# Altium schematic sheet p2_half_bridge.SchDoc
size A1; Organization: Protel International P/L; Address1: L3, 12a Rodborough Rd; Address2: Frenchs Forest; Address3: NSW; Address4: Australia 2086
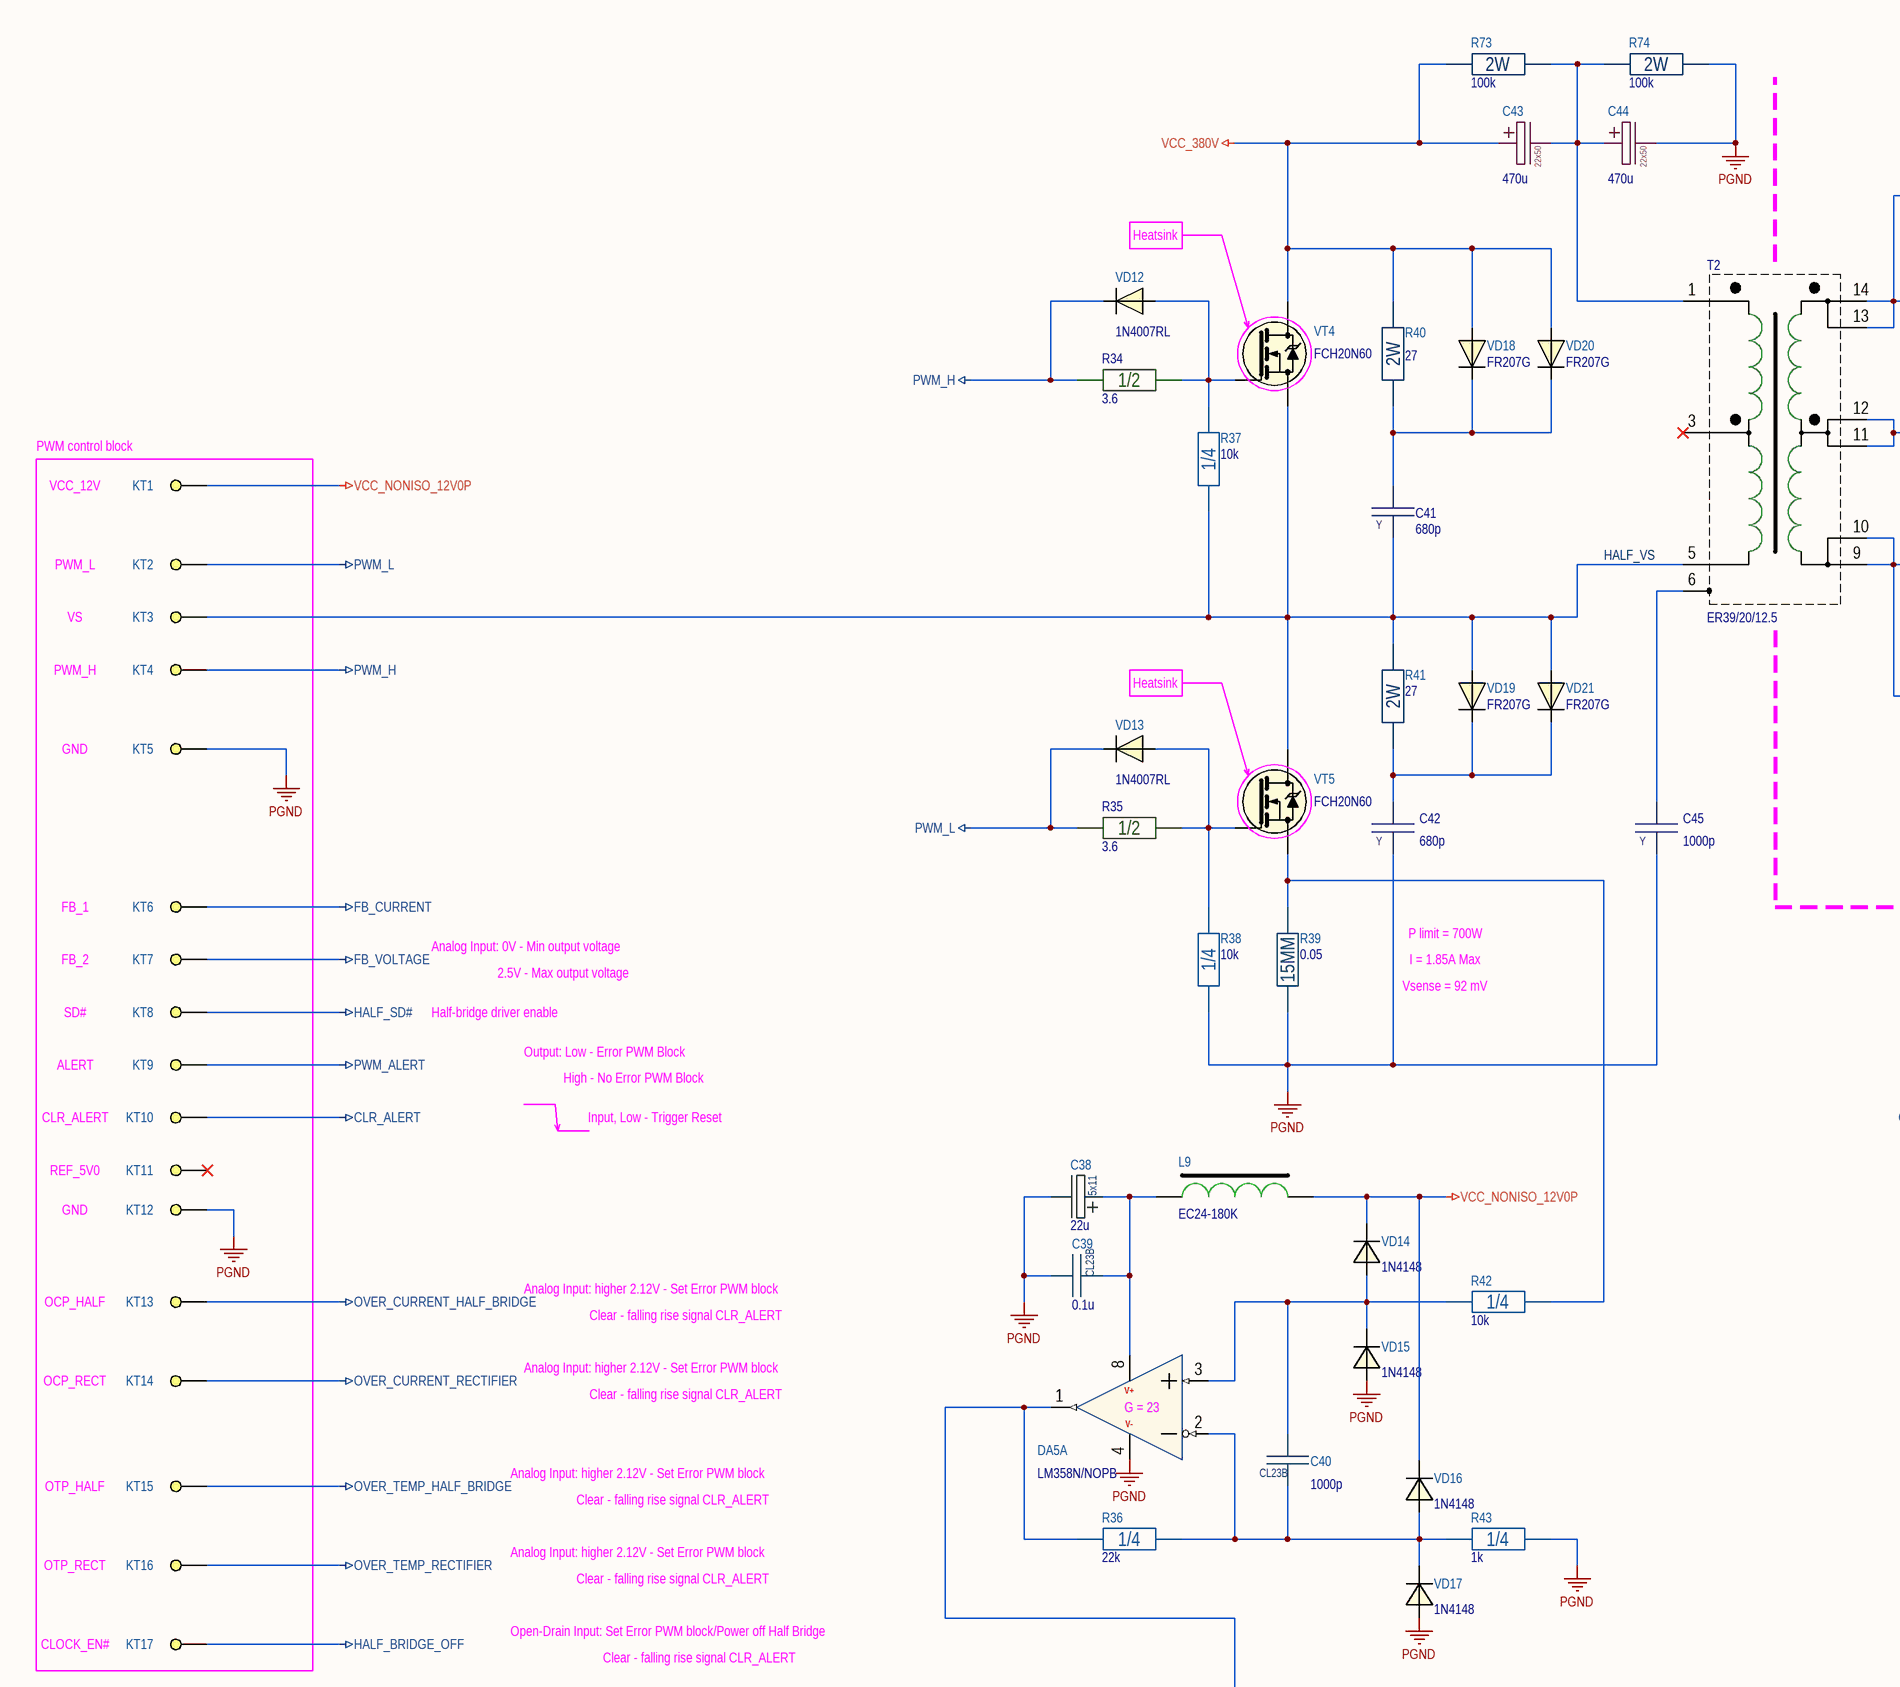
[diagram p0: p2_half_bridge.SchDoc, top left]
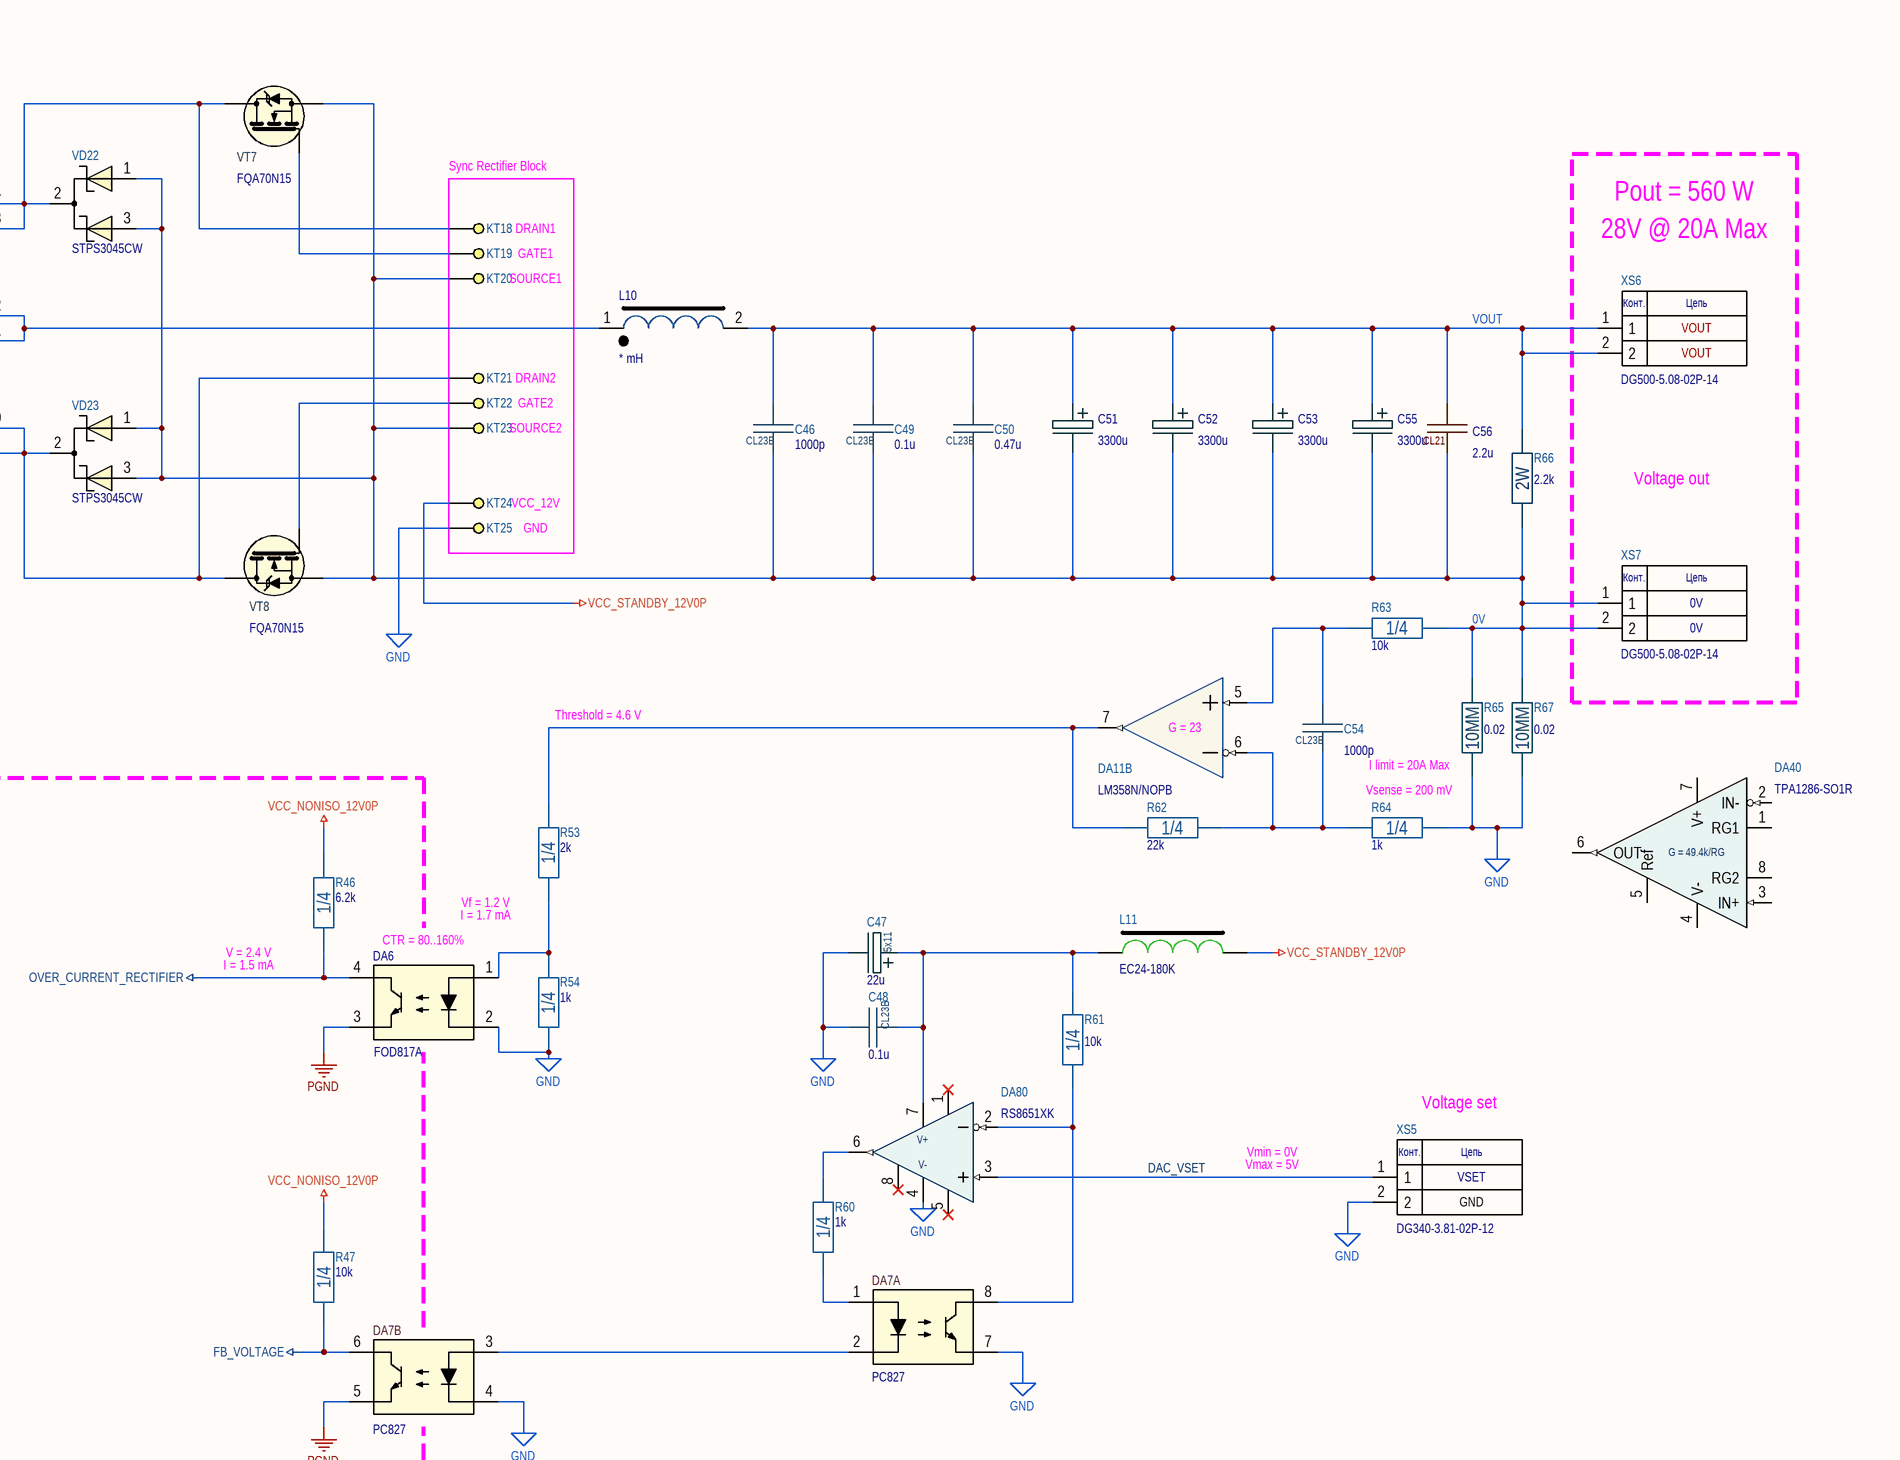
[diagram p1: p2_half_bridge.SchDoc, top right]
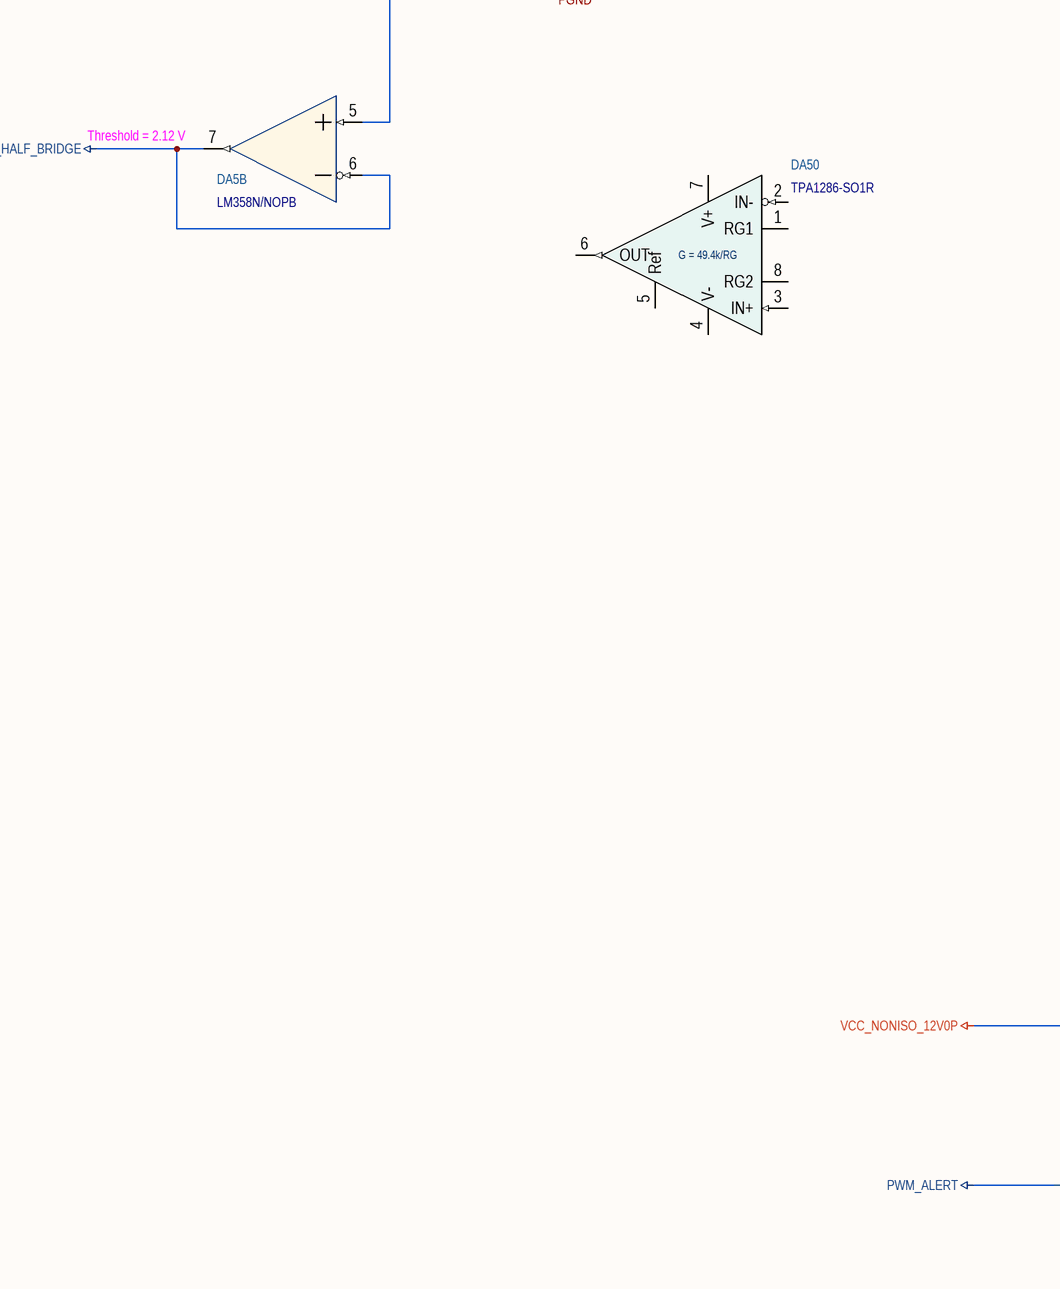
[diagram p2: p2_half_bridge.SchDoc, bottom left]
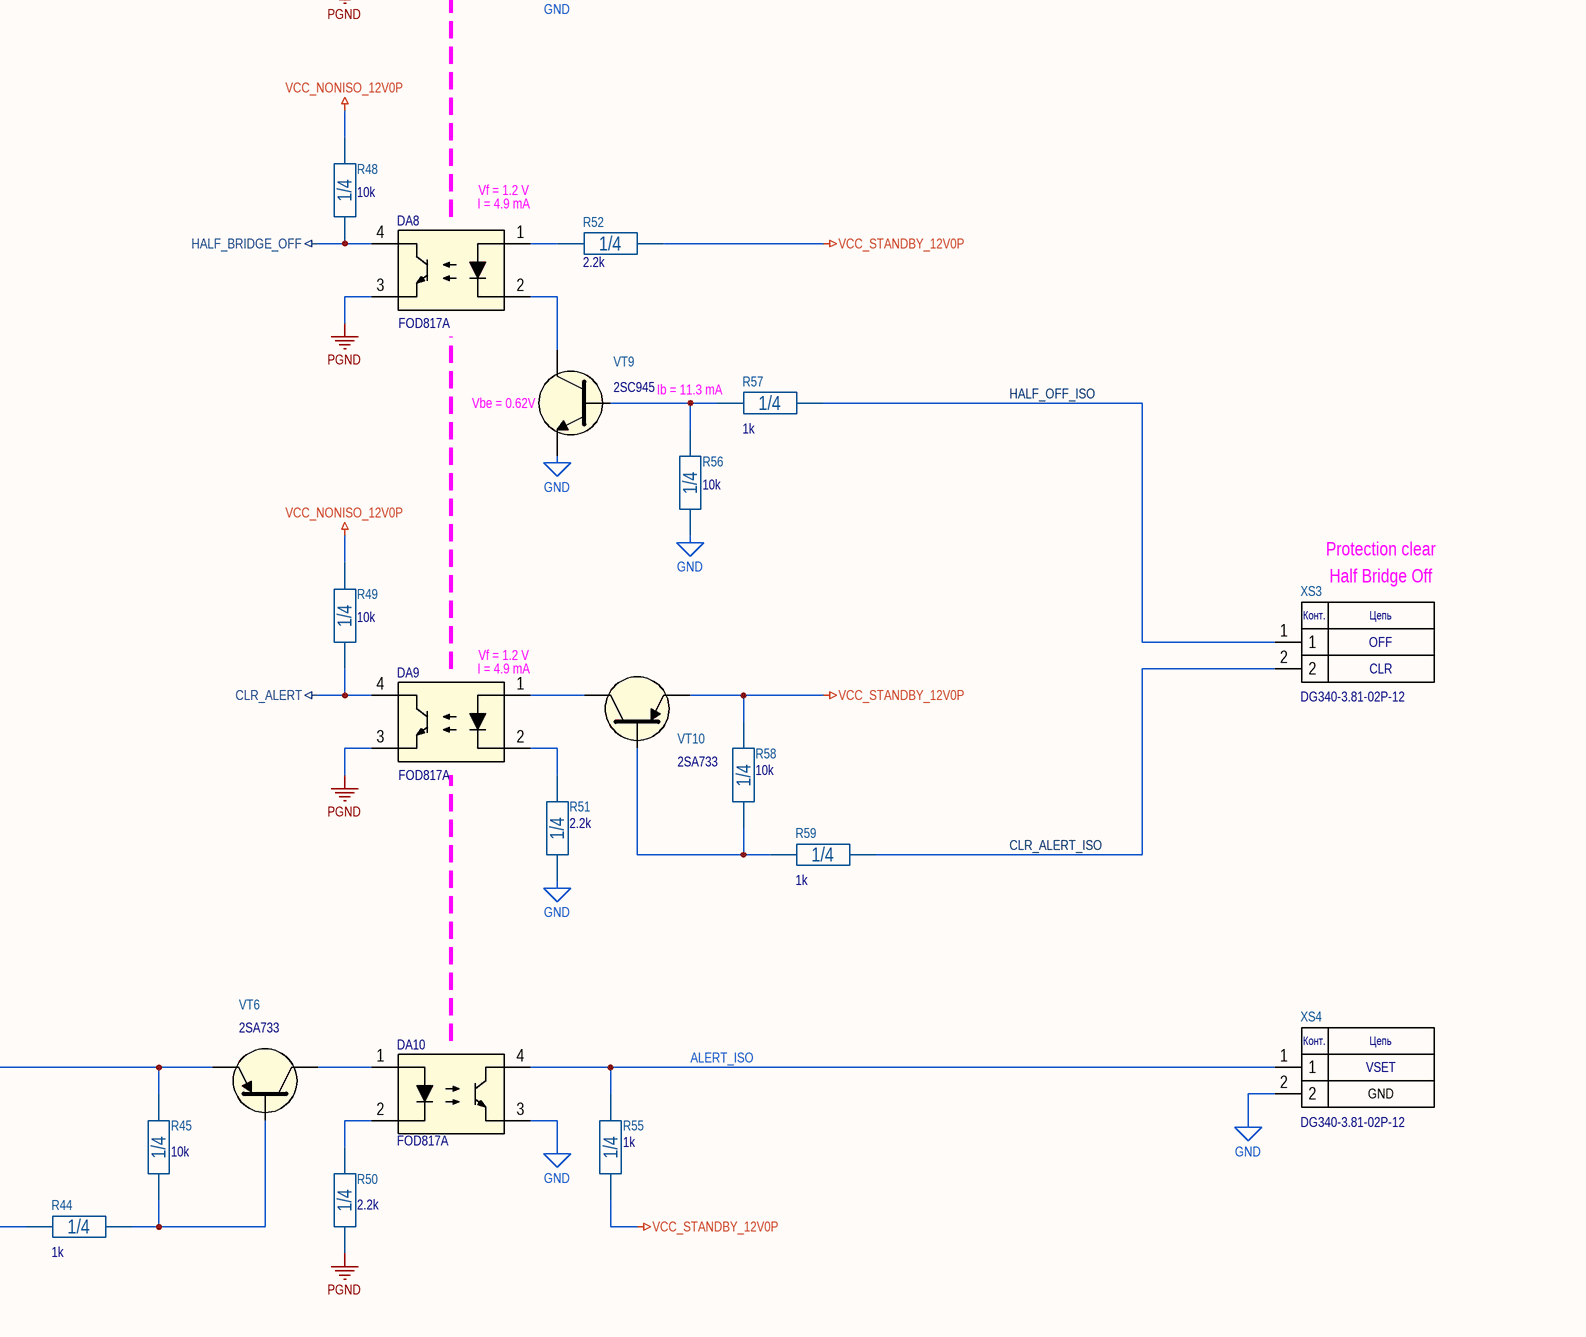
[diagram p3: p2_half_bridge.SchDoc, bottom right]

## Parts
C38  22u  Package: 5x11  [ECAP5X11X2.0_BRW]
C39  0.1u  [CL23B_7.2x2.5]
C40  1000p  [CL23B_7.2x2.5]
C41  680p  Package: Y  [JYC_Y2_CAP_7.5]
C42  680p  Package: Y  [JYC_Y2_CAP_7.5]
C43  470u  Package: 22x50  [ECAP22X50X10]
C44  470u  Package: 22x50  [ECAP22X50X10]
C45  1000p  Package: Y  [JYC_Y2_CAP_7.5]
C46  1000p  [CL23B_7.2x2.5]
C47  22u  Package: 5x11  [ECAP5X11X2.0_BRW]
C48  0.1u  [CL23B_7.2x2.5]
C49  0.1u  [CL23B_7.2x2.5]
C50  0.47u  [CL23B_7.2x3.5]
C51  3300u  [ECAP16X36X75_BLK]
C52  3300u  [ECAP16X36X75_BLK]
C53  3300u  [ECAP16X36X75_BLK]
C54  1000p  [CL23B_7.2x2.5]
C55  3300u  [ECAP16X36X75_BLK]
C56  2.2u  [CL21_29x24.5x14.0_P27.5]
DA5  LM358N/NOPB  [DIP-8P-M01_with_SO8]  (parts A,B of 2)
DA6  FOD817A  [DIP-4P]
DA7  PC827  [DIP-8P-M01]  (parts A,B of 2)
DA8  FOD817A  [DIP-4P]
DA9  FOD817A  [DIP-4P]
DA10  FOD817A  [DIP-4P]
DA11  LM358N/NOPB  [DIP-8P-M01_with_SO8]  (part B of 2)
DA40  TPA1286-SO1R  [SOIC-8]
DA50  TPA1286-SO1R  [SOIC-8]
DA80  RS8651XK  [SOIC-8]
KT1  TEST_PAD  [TEST_PAD_HOLE1.1x1.8SQ]  (value not drawn)  (net tie, no BOM)
KT2  TEST_PAD  [TEST_PAD_HOLE1.1x1.8]  (value not drawn)  (net tie, no BOM)
KT3  TEST_PAD  [TEST_PAD_HOLE1.1x1.8]  (value not drawn)  (net tie, no BOM)
KT4  TEST_PAD  [TEST_PAD_HOLE1.1x1.8]  (value not drawn)  (net tie, no BOM)
KT5  TEST_PAD  [TEST_PAD_HOLE1.1x1.8]  (value not drawn)  (net tie, no BOM)
KT6  TEST_PAD  [TEST_PAD_HOLE1.1x1.8]  (value not drawn)  (net tie, no BOM)
KT7  TEST_PAD  [TEST_PAD_HOLE1.1x1.8]  (value not drawn)  (net tie, no BOM)
KT8  TEST_PAD  [TEST_PAD_HOLE1.1x1.8]  (value not drawn)  (net tie, no BOM)
KT9  TEST_PAD  [TEST_PAD_HOLE1.1x1.8]  (value not drawn)  (net tie, no BOM)
KT10  TEST_PAD  [TEST_PAD_HOLE1.1x1.8]  (value not drawn)  (net tie, no BOM)
KT11  TEST_PAD  [TEST_PAD_HOLE1.1x1.8]  (value not drawn)  (net tie, no BOM)
KT12  TEST_PAD  [TEST_PAD_HOLE1.1x1.8]  (value not drawn)  (net tie, no BOM)
KT13  TEST_PAD  [TEST_PAD_HOLE1.1x1.8]  (value not drawn)  (net tie, no BOM)
KT14  TEST_PAD  [TEST_PAD_HOLE1.1x1.8]  (value not drawn)  (net tie, no BOM)
KT15  TEST_PAD  [TEST_PAD_HOLE1.1x1.8]  (value not drawn)  (net tie, no BOM)
KT16  TEST_PAD  [TEST_PAD_HOLE1.1x1.8]  (value not drawn)  (net tie, no BOM)
KT17  TEST_PAD  [TEST_PAD_HOLE1.1x1.8]  (value not drawn)  (net tie, no BOM)
KT18  TEST_PAD  [TEST_PAD_HOLE1.1x1.8]  (value not drawn)  (net tie, no BOM)
KT19  TEST_PAD  [TEST_PAD_HOLE1.1x1.8]  (value not drawn)  (net tie, no BOM)
KT20  TEST_PAD  [TEST_PAD_HOLE1.1x1.8]  (value not drawn)  (net tie, no BOM)
KT21  TEST_PAD  [TEST_PAD_HOLE1.1x1.8]  (value not drawn)  (net tie, no BOM)
KT22  TEST_PAD  [TEST_PAD_HOLE1.1x1.8]  (value not drawn)  (net tie, no BOM)
KT23  TEST_PAD  [TEST_PAD_HOLE1.1x1.8]  (value not drawn)  (net tie, no BOM)
KT24  TEST_PAD  [TEST_PAD_HOLE1.1x1.8]  (value not drawn)  (net tie, no BOM)
KT25  TEST_PAD  [TEST_PAD_HOLE1.1x1.8]  (value not drawn)  (net tie, no BOM)
L9  EC24-180K  [EC24_GREEN_VERT]
L10  * mH  [CORE_D33_GB]
L11  EC24-180K  [EC24_GREEN]
R34  3.6  Package: 1/2  [CFR-50(VERTICAL)]
R35  3.6  Package: 1/2  [CFR-50(VERTICAL)]
R36  22k  Package: 1/4  [CFR-25(VERTICAL)]
R37  10k  Package: 1/4  [CFR-25]
R38  10k  Package: 1/4  [CFR-25]
R39  0.05  Package: 15MM  [CURRENT_SENSE_15x18mm]
R40  27  Package: 2W  [CFR-200(VERTICAL)]
R41  27  Package: 2W  [CFR-200(VERTICAL)]
R42  10k  Package: 1/4  [CFR-25(VERTICAL)]
R43  1k  Package: 1/4  [CFR-25(VERTICAL)]
R44  1k  Package: 1/4  [CFR-25(VERTICAL)]
R45  10k  Package: 1/4  [CFR-25(VERTICAL)]
R46  6.2k  Package: 1/4  [CFR-25(VERTICAL)]
R47  10k  Package: 1/4  [CFR-25(VERTICAL)]
R48  10k  Package: 1/4  [CFR-25(VERTICAL)]
R49  10k  Package: 1/4  [CFR-25(VERTICAL)]
R50  2.2k  Package: 1/4  [CFR-25(VERTICAL)]
R51  2.2k  Package: 1/4  [CFR-25(VERTICAL)]
R52  2.2k  Package: 1/4  [CFR-25(VERTICAL)]
R53  2k  Package: 1/4  [CFR-25(VERTICAL)]
R54  1k  Package: 1/4  [CFR-25(VERTICAL)]
R55  1k  Package: 1/4  [CFR-25(VERTICAL)]
R56  10k  Package: 1/4  [CFR-25(VERTICAL)]
R57  1k  Package: 1/4  [CFR-25(VERTICAL)]
R58  10k  Package: 1/4  [CFR-25(VERTICAL)]
R59  1k  Package: 1/4  [CFR-25(VERTICAL)]
R60  1k  Package: 1/4  [CFR-25(VERTICAL)]
R61  10k  Package: 1/4  [CFR-25]
R62  22k  Package: 1/4  [CFR-25]
R63  10k  Package: 1/4  [CFR-25(VERTICAL)]
R64  1k  Package: 1/4  [CFR-25(VERTICAL)]
R65  0.02  Package: 10MM  [CURRENT_SENSE_10x11mm]
R66  2.2k  Package: 2W  [CFR-200(VERTICAL)]
R67  0.02  Package: 10MM  [CURRENT_SENSE_10x11mm]
R73  100k  Package: 2W  [CFR-200(VERTICAL)]
R74  100k  Package: 2W  [CFR-200(VERTICAL)]
T2  ER39/20/12.5  [ER39/20/12.5]
VD12  1N4007RL  [DO-41]
VD13  1N4007RL  [DO-41]
VD14  1N4148  [DO-35 GLASS LIGHT RED]
VD15  1N4148  [DO-35 GLASS LIGHT RED]
VD16  1N4148  [DO-35 GLASS LIGHT RED]
VD17  1N4148  [DO-35 GLASS LIGHT RED]
VD18  FR207G  [DO-15]
VD19  FR207G  [DO-15]
VD20  FR207G  [DO-15]
VD21  FR207G  [DO-15]
VD22  STPS3045CW  [TO-247_with_TO-220 (VERTICAL)]
VD23  STPS3045CW  [TO-247_with_TO-220 (VERTICAL)]
VT4  FCH20N60  [TO-247_with_TO-220 (VERTICAL)]
VT5  FCH20N60  [TO-247_with_TO-220 (VERTICAL)]
VT6  2SA733  [TO-92 (VERTICAL,LINE)]
VT7  FQA70N15  [TO-3PN_with_TO-220 (VERTICAL)]
VT8  FQA70N15  [TO-3PN_with_TO-220 (VERTICAL)]
VT9  2SC945  [TO-92 (VERTICAL,LINE)]
VT10  2SA733  [TO-92 (VERTICAL,LINE)]
XS3  DG340-3.81-02P-12  [DG340-3.81-02P]
XS4  DG340-3.81-02P-12  [DG340-3.81-02P]
XS5  DG340-3.81-02P-12  [DG340-3.81-02P]
XS6  DG500-5.08-02P-14  [DG500-5.08-02P]
XS7  DG500-5.08-02P-14  [DG500-5.08-02P]

## Nets
CLR_ALERT: DA9.4(COLLECTOR) KT10.1 R49.2
FB_CURRENT: KT6.1
FB_VOLTAGE: DA7.6(COLLECTOR2) KT7.1 R47.1
GND: C47.2 C48.2 DA6.2(CATHODE) DA7.4(CATHODE2) DA7.7(EMITTER1) DA10.3(EMITTER) DA80.4(V-) KT25.1 R51.1 R54.2 R56.2 R64.2 R65.1 R67.1 VT9.3(E) XS4.2 XS5.2
HALF_BRIDGE_OFF: DA8.4(COLLECTOR) KT17.1 R48.2
HALF_SD#: KT8.1
OVER_CURRENT_HALF_BRIDGE: DA5.6(2IN-) DA5.7(2OUT) KT13.1
OVER_CURRENT_RECTIFIER: DA6.4(COLLECTOR) KT14.1 R46.2
OVER_TEMP_HALF_BRIDGE: KT15.1
OVER_TEMP_RECTIFIER: KT16.1
PGND: C38.2 C39.2 C42.1 C44.2 C45.1 DA5.4(V-) DA6.3(EMITTER) DA7.5(EMITTER2) DA8.3(EMITTER) DA9.3(EMITTER) KT5.1 KT12.1 R38.1 R39.1 R43.1 R50.1 R74.1 VD15.2 VD17.2
PWM_ALERT: KT9.1 R44.1
PWM_H: KT4.1 R34.2 VD12.1(C)
PWM_L: KT2.1 R35.2 VD13.1(C)
VCC_380V: C43.1 R40.2 R73.2 VD18.2(A) VD20.2(A) VT4.2(D)
VCC_NONISO_12V0P: KT1.1 L9.2 R45.2 R46.1 R47.2 R48.1 R49.1 VD14.1 VD16.1 VT6.3(E)
VCC_STANDBY_12V0P: KT24.1 L11.2 R52.1 R55.1 R58.2 VT10.3(E)
0V: C46.1 C49.1 C50.1 C51.2 C52.2 C53.2 C55.2 C56.1 KT20.1 KT23.1 R63.2 R65.2 R66.1 R67.2 VD22.1(A1) VD22.3(A2) VD23.1(A1) VD23.3(A2) VT7.3(S) VT8.3(S) XS7.1 XS7.2
ALERT_ISO: DA10.4(COLLECTOR) R55.2 XS4.1
CLR_ALERT_ISO: R59.2 XS3.2
DAC_VSET: DA80.3(IN+) XS5.1
HALF_OFF_ISO: R57.2 XS3.1
HALF_VS: C41.1 KT3.1 R37.1 R41.1 T2.5 VD19.2(A) VD21.2(A) VT4.3(S) VT5.2(D)
VOUT: C46.2 C49.2 C50.2 C51.1 C52.1 C53.1 C55.1 C56.2 L10.2 R66.2 XS6.1 XS6.2
NetC38_1: C38.1 C39.1 DA5.8(V+) L9.1
NetC40_1: C40.1 DA5.3(1IN+) R42.2 VD14.2 VD15.1
NetC40_2: C40.2 DA5.2(1IN-) R36.1 R43.2 VD16.2 VD17.1
NetC41_2: C41.2 R40.1 VD18.1(C) VD20.1(C)
NetC42_2: C42.2 R41.2 VD19.1(C) VD21.1(C)
NetC43_2: C43.2 C44.1 R73.1 R74.2 T2.1
NetC45_2: C45.2 T2.6
NetC47_1: C47.1 C48.1 DA80.7(V+) L11.1 R61.1
NetC54_1: C54.1 DA11.5(2IN+) R63.1
NetC54_2: C54.2 DA11.6(2IN-) R62.1 R64.1
NetDA5_1: DA5.1(1OUT) DA5.5(2IN+) R36.2
NetDA6_1: DA6.1(ANODE) R53.1 R54.1
NetDA7_1: DA7.1(ANODE1) R60.1
NetDA7_2: DA7.2(CATHODE1) DA7.3(ANODE2)
NetDA7_8: DA7.8(COLLECTOR1) DA80.2(IN-) R61.2
NetDA8_1: DA8.1(ANODE) R52.2
NetDA8_2: DA8.2(CATHODE) VT9.2(C)
NetDA9_1: DA9.1(ANODE) VT10.2(C)
NetDA9_2: DA9.2(CATHODE) R51.2
NetDA10_1: DA10.1(ANODE) VT6.2(C)
NetDA10_2: DA10.2(CATHODE) R50.2
NetDA11_7: DA11.7(2OUT) R53.2 R62.2
NetDA80_6: DA80.6(OUT) R60.2
NetKT18_1: KT18.1 T2.13 T2.14 VD22.2(C) VT7.2(D)
NetKT19_1: KT19.1 VT7.1(G)
NetKT21_1: KT21.1 T2.9 T2.10 VD23.2(C) VT8.2(D)
NetKT22_1: KT22.1 VT8.1(G)
NetL10_1: L10.1 T2.11 T2.12
NetR34_1: R34.1 R37.2 VD12.2(A) VT4.1(G)
NetR35_1: R35.1 R38.2 VD13.2(A) VT5.1(G)
NetR39_2: R39.2 R42.1 VT5.3(S)
NetR44_2: R44.2 R45.1 VT6.1(B)
NetR56_1: R56.1 R57.1 VT9.1(B)
NetR58_1: R58.1 R59.1 VT10.1(B)

Not connected (* = marked no-connect by the designer): DA40 1(RG1) 2(IN-) 3(IN+) 4(V-) 5(Ref) 6(OUT) 7(V+) 8(RG2); DA50 1(RG1) 2(IN-) 3(IN+) 4(V-) 5(Ref) 6(OUT) 7(V+) 8(RG2); DA80 1(NC)* 5(NC)* 8(NC)*; KT11 1*; T2 3*

## Notes on the sheet
- Heatsink
- Sync Rectifier Block
- Pout = 560 W
- DRAIN1
- SOURCE1
- GATE1
- 28V @ 20A Max
- (near KT1) PWM control block
- VOUT
- VCC_12V
- DRAIN2
- GATE2
- PWM_L
- SOURCE2
- VS
- GND
- Voltage out
- PWM_H
- 0V
- Threshold = 4.6 V
- FB_1
- (near DA11) G = 23
- (near R65) I limit = 20A Max
- Vsense = 200 mV
- FB_2
- Analog Input: 0V - Min output voltage
- 2.5V - Max output voltage
- I = 1.85A Max
- P limit = 700W
- Vsense = 92 mV
- SD#
- Half-bridge driver enable
- Output: Low - Error PWM Block
- (near R53) Vf = 1.2 V
- I = 1.7 mA
- ALERT
- CLR_ALERT
- High - No Error PWM Block
- Input, Low - Trigger Reset
- (near R46) V = 2.4 V
- (near R46) I = 1.5 mA
- (near DA6) CTR = 80..160%
- REF_5V0
- Voltage set
- OCP_HALF
- Analog Input: higher 2.12V - Set Error PWM block
- Clear - falling rise signal CLR_ALERT
- Vmin = 0V
- Vmax = 5V
- OCP_RECT
- VSET
- (near DA5) G = 23
- OTP_HALF
- OTP_RECT
- CLOCK_EN#
- Open-Drain Input: Set Error PWM block/Power off Half Bridge
- (near DA5) Threshold = 2.12 V
- Vf = 1.2 V
- (near DA8) I = 4.9 mA
- (near VT9) Vbe = 0.62V
- (near R57) Ib = 11.3 mA
- Protection clear
- Half Bridge Off
- OFF
- (near DA9) Vf = 1.2 V
- (near DA9) I = 4.9 mA
- CLR
- Title
- Size:
- Date:
- File:
- A1
- Number:
- Time:
- Revision:
- Sheet
- of
- (in symbol DG340-3.81-02P-12) Конт.; Цепь
- (in symbol DG500-5.08-02P-14) Конт.; Цепь
- (in symbol TPA1286-SO1R) G = 49.4k/RG

## Library data of the parts
C38 C47 = C_ECAP: Aluminium capacitor; Part Number: UVR1J220MDD; Manufacturer: Nichicon; Tolerance: ± 20 %; Voltage: 63V; Value: 22u; Value on schem: 22u
C39 C40 C46 C48-C50 C54 = CL23B: Box-type metallized polyester film capacitor; Tolerance: ± * %; Voltage: 63V; Dielectric: Polyester; Part Number: *; Manufacturer: *; Package: CL23B
  C39 C48 C49: Value: 0.1u; Value on schem: 0.1u
  C40 C46 C54: Value: 1000p; Value on schem: 1000p
  C50: Value: 0.47u; Value on schem: 0.47u
C41 C42 = JB_Y2: High Voltage Ceramic Capacitor; Part Number: JYC3D681KBB; Manufacturer: JB; Tolerance: ± 10 %; Dielectric: Y5P; Voltage: 2000V; Value: 680p; Value on schem: 680p
C43 C44 = ECAP_22x50: Aluminium capacitors 35x50mm; Part Number: UPW2D471MRD; Manufacturer: Nichicon; Tolerance: ± 20 %; Voltage: 200V; Value: 470u; Value on schem: 470u
C45 = JB_Y2: High Voltage Ceramic Capacitor; Part Number: JYC3D102MBE; Manufacturer: JB; Tolerance: ± 20 %; Dielectric: Y5U; Voltage: 2000V; Value: 1000p; Value on schem: 1000p
C51-C53 C55 = C_ECAP: Aluminium capacitor; Part Number: RD1H338M1635MPA; Manufacturer: Samwha; Tolerance: ± 20 %; Voltage: 50V; Value: 3300u; Value on schem: 3300u; Package: 16x36
C56 = CL21: CL21 Type Metallized Polyester Film Capacitor; Tolerance: ± * %; Voltage: 250V; Value: 2.2u; Dielectric: Polyester; Value on schem: 2.2u; Part Number: *; Manufacturer: *; Package: CL21
DA5 DA11 = LM358N/NOPB: Low-Power, Dual-Operational Amplifiers; Manufacturer: Texas Instruments; Part Number: LM358N/NOPB; Package: DIP-8
DA6 DA8-DA10 = FOD817A: 5kV Phototransistor Optocoupler; Manufacturer: ON Semiconductor; Package: DIP-4; Part Number: FOD817A
DA7 = PC827: High Density Mounting Type Photocoupler; Manufacturer: Sharp; Package: DIP-8; Part Number: PC827
DA40 DA50 = TPA1286-SO1R: High Voltage, Precision, Zero-drift, Instrumentation Amplifier; Manufacturer: 3PEAK; Part Number: TPA1286-SO1R; Package: SOIC-8
DA80 = RS8651XK: Precision, Zero-Drift, Rail-to-Rail Out, High-Voltage(32V) Operational Amplifier; Manufacturer: Jiangsu Runic Technology; Package: SOIC-8; Part Number: RS8651XK
KT1-KT25 = TEST_PAD: Test pad
L9 L11 = EC24: Axial leaded coated inductors; Manufacturer: 3L Electronic; RDC: 1 Ohm; SRF Min: 15 MHz; Q: 40; Irms  Max: 315 mA; Inductance @ 100 kHz: 18 µH; Part Number: EC24-180K; Package: EC24
L10 = CORE_D33: Ferrite Core D32.8/20.1/10.7 mm; Core: D33; Value: * mH
R34 R35 = CF50: Resistor 1/2W; Part Number: MFR-50JT-52-3R6; Manufacturer: Yageo; Tolerance: ± 5 %; Voltage: 350V; Temperature Coefficient: 200 ppm/K; Value: 3.6; Value on schem: 3.6
R36 R62 = CF25: Resistor 1/4W; Part Number: MFR-25FTF52-22K; Manufacturer: Yageo; Tolerance: ± 1 %; Voltage: 250V; Temperature Coefficient: ±100 ppm/°C; Value: 22k; Value on schem: 22k
R37 R38 R42 R45 R47-R49 R56 R58 R61 R63 = CF25: Resistor 1/4W; Part Number: MFR-25FTF52-10K; Manufacturer: Yageo; Tolerance: ± 1 %; Voltage: 250V; Temperature Coefficient: ±100 ppm/°C; Value: 10k; Value on schem: 10k
R39 = SHUNT_15MM: Constantan shunt resistor, pitch = 15mm; Tolerance: ±  %; Temperature Coefficient: ±*/°C; Value: 0.05; Value on schem: 0.05; Part Number: *; Manufacturer: *; Voltage: *
R40 R41 = CF200: Resistor 2W; Part Number: KNP200JB-73-27R; Manufacturer: Yageo; Tolerance: ± 5 %; Voltage: 250V; Temperature Coefficient: ±300 ppm/°C; Value: 27; Value on schem: 27
R43 R44 R54 R55 R57 R59 R60 R64 = CF25: Resistor 1/4W; Part Number: MFR-25FTF52-1K; Manufacturer: Yageo; Tolerance: ± 1 %; Voltage: 250V; Temperature Coefficient: ±100 ppm/°C; Value: 1k; Value on schem: 1k
R46 = CF25: Resistor 1/4W; Part Number: MFR-25FTF52-5.1K; Manufacturer: Yageo; Tolerance: ± 1 %; Voltage: 250V; Temperature Coefficient: ±100 ppm/°C; Value: 6.2k; Value on schem: 6.2k
R50-R52 = CF25: Resistor 1/4W; Part Number: MFR-25FTF52-2K2; Manufacturer: Yageo; Tolerance: ± 1 %; Voltage: 250V; Temperature Coefficient: ±100 ppm/°C; Value: 2.2k; Value on schem: 2.2k
R53 = CF25: Resistor 1/4W; Part Number: MFR-25FTF52-2K; Manufacturer: Yageo; Tolerance: ± 1 %; Voltage: 250V; Temperature Coefficient: ±100 ppm/°C; Value: 2k; Value on schem: 2k
R65 R67 = SHUNT_10MM: Constantan shunt resistor, pitch = 10mm; Tolerance: ± 5 %; Temperature Coefficient: ±*/°C; Value: 0.02; Value on schem: 0.02; Part Number: *; Manufacturer: *; Voltage: *
R66 = CF200: Resistor 2W; Part Number: KNP200JB-73-2K2; Manufacturer: Yageo; Tolerance: ± 5 %; Voltage: 250V; Temperature Coefficient: ±300 ppm/°C; Value: 2.2k; Value on schem: 2.2k
R73 R74 = CF200: Resistor 2W; Part Number: MFR200JT-73-100K; Manufacturer: Yageo; Tolerance: ± 5 %; Voltage: 250V; Temperature Coefficient: ±200 ppm/°C; Value: 100k; Value on schem: 100k
T2 = ER39: EE39 Ferrite Core, with footprint for ER35, EE33, EI33 etc.; Value: ER39/20/12.5
VD12 VD13 = 1N4007RL: 1A 1000V Standard Recovery Rectifiers Diode; Manufacturer: ON Semiconductor; Part Number: 1N4007RL; Package: DO-41
VD14-VD17 = 1N4148: High-speed diode; Package: DO-35; Part Number: 1N4148
VD18-VD21 = FR207G: Diode 2A, 1000V Glass Passivated Fast Recovery Rectifiers; Manufacturer: Taiwan Semiconductor Corporation; Package: DO-15; Part Number: FR207G
VD22 VD23 = STPS3045CW: Power Schottky Rectifier Diode 45V, 2x15A; Manufacturer: STMicroelectronics; Package: TO-247AC; Part Number: STPS3045CW
VT4 VT5 = FCH20N60: 600V @ 20A N-Channel MOSFET; Manufacturer: ON Semiconductor; Part Number: FCH20N60; Package: TO-247
VT6 VT10 = 2SA733: General Purpose p-n-p Transistors; Manufacturer: NEC; Package: TO-92; Part Number: 2SA733
VT7 VT8 = FQA70N15: 150V @ 70A 28 mΩ N-Channel MOSFET; Manufacturer: ON Semiconductor; Part Number: FQA70N15; Package: TO-3PN
VT9 = 2SC945: General Purpose n-p-n Transistors; Manufacturer: NEC; Package: TO-92; Part Number: 2SC945
XS3-XS5 = DG340-3.81-02P-12: 2-way screw terminal, pitch 150mils (3.81mm); Manufacturer: DEGSON; Part Number: DG340-3.81-02P-12
XS6 XS7 = DG500-5.08-02P-14: 2-way screw terminal, pitch 200mils (5.08mm); Manufacturer: DEGSON; Part Number: DG500-5.08-02P-14